# EAGLE design ELEKTRA-PMIC v0.3-35X22.86-0.8-323 (EAGLE 9.6.2)
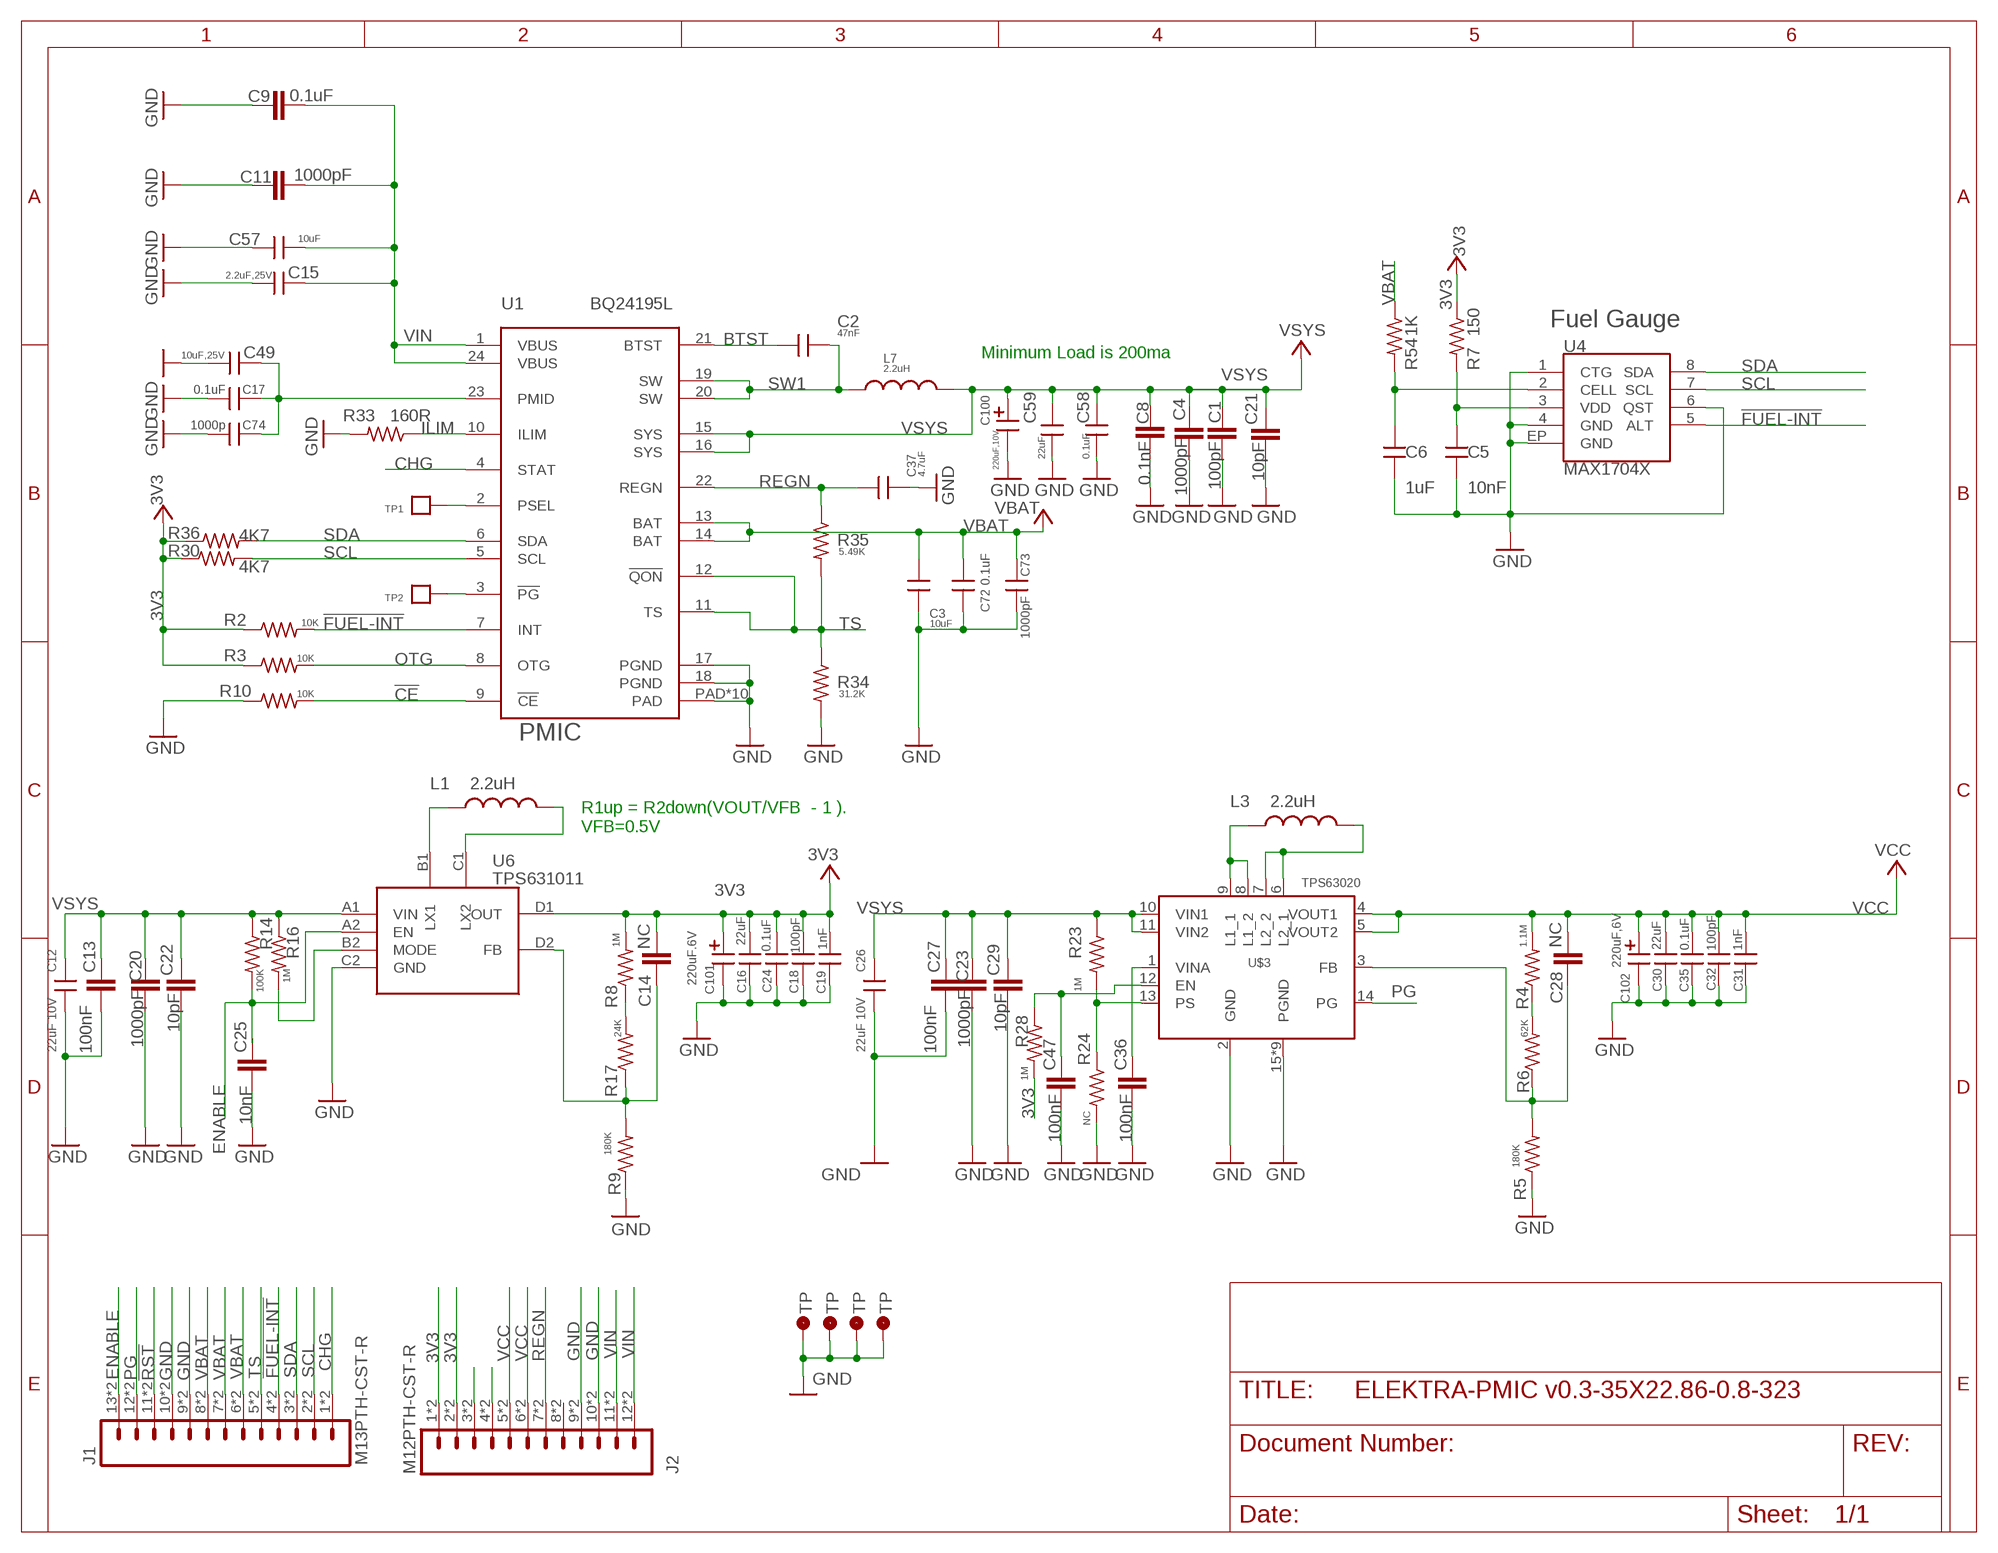
[diagram p0: schematic, sheet 1]

## Parts
C1  100pF  CAP_1  [C0402_B]
C2  47nF  CAP0402  [C-0402]
C3  10uF  CAPC0805  [C0805]
C4  1000pF  CAP_1  [C0402_B]
C5  10nF  CAP0402A  [C0402]
C6  1uF  CAP0402A  [C0402]
C8  0.1nF  CAP_1  [C0402_B]
C9  0.1uF  CAP_1  [C0402_B]
C11  1000pF  CAP_1  [C0402_B]
C12  22uF 10V  CAPC0805  [C0805]
C13  100nF  CAP_1  [C0402_B]
C14  NC  CAP_1  [C0402_B]
C15  2.2uF,25V  CAP0603A  [C-0603A]
C16  22uF  CAP0603A  [C-0603A]
C17  0.1uF  CAP0402A  [C0402]
C18  100pF  CAP0402A  [C0402]
C19  1nF  CAP0402A  [C0402]
C20  1000pF  CAP_1  [C0402_B]
C21  10pF  CAP_1  [C0402_B]
C22  10pF  CAP_1  [C0402_B]
C23  1000pF  CAP_1  [C0402_B]
C24  0.1uF  CAP0402A  [C0402]
C25  10nF  CAP_1  [C0402_B]
C26  22uF 10V  CAPC0805  [C0805]
C27  100nF  CAP_1  [C0402_B]
C28  NC  CAP_1  [C0402_B]
C29  10pF  CAP_1  [C0402_B]
C30  22uF  CAP0603A  [C-0603A]
C31  1nF  CAP0402A  [C0402]
C32  100pF  CAP0402A  [C0402]
C35  0.1uF  CAP0402A  [C0402]
C36  100nF  CAP_1  [C0402_B]
C37  4.7uF  CAP0402A  [C0402]
C47  100nF  CAP_1  [C0402_B]
C49  10uF,25V  CAP0603A  [C-0603A]
C57  10uF  CAP0603A  [C-0603A]
C58  0.1uF  CAP0402A  [C0402]
C59  22uF  CAPC0603  [C0603]
C72  0.1uF  CAP0402  [C-0402]
C73  1000pF  CAP0402  [C-0402]
C74  1000p  CAP0402  [C-0402]
C100  220uF,10V  CAP-ECASE_B  [CASE-B]
C101  220uF.6V  CAP-ECASE_B  [CASE-B]
C102  220uF,6V  CAP-ECASE_B  [CASE-B]
J1  M13PTH-CST-R  [1X13-CASTELLATED]
J2  M12PTH-CST-R  [1X12-CASTELLATED]
L1  2.2uH  INDUCTOR-SPARKFUNINDUCTOR-2520  [INDUCTOR-2520]
L3  2.2uH  INDUCTOR-SPARKFUNINDUCTOR-2520  [INDUCTOR-2520]
L7  2.2uH  INDUCTORI  [INDUCTOR-4040]
R2  10K  R-US_  [R0402_B]
R3  10K  R-US_  [R0402_B]
R4  1.1M  R-US_  [R0402_B]
R5  180K  R-US_  [R0402_B]
R6  62K  R-US_  [R0402_B]
R7  150  R-US_  [R0402_B]
R8  1M  R-US_  [R0402_B]
R9  180K  R-US_  [R0402_B]
R10  10K  R-US_  [R0402_B]
R14  100K  R-US_  [R0402_B]
R16  1M  R-US_  [R0402_B]
R17  24K  R-US_  [R0402_B]
R23  1M  R-US_  [R0402_B]
R24  NC  R-US_  [R0402_B]
R28  1M  R-US_  [R0402_B]
R30  4K7  R-US_  [R0402_B]
R33  160R  R-US_  [R0402_B]
R34  31.2K  R-US_  [R0402_B]
R35  5.49K  R-US_  [R0402_B]
R36  4K7  R-US_  [R0402_B]
R54  1K  R-US_  [R0402_B]
TP1  TP1311MM  [TP-1311MM]
TP2  TP1311MM  [TP-1311MM]
U1  BQ24195L  BQ24298RTWR  [QFN24]
U4  MAX1704X  [TDFN-8]
U6  TPS631011  TPS631010  [DSBGA]
U$1  TP  [TP_2.33X1.37]
U$2  TP  [TP_2.33X1.37]
U$3  TPS63020  [TPS63020]
U$4  TP  [TP_2.33X1.37]
U$5  TP  [TP_2.33X1.37]

## Nets
3V3: C14.2 C16.1 C18.1 C19.1 C24.1 C101.P$1 J2.1 J2.2 J2.@1 J2.@2 R2.1 R3.1 R7.1 R8.2 R28.2 R30.1 R36.1 U6.D1(OUT)
!CE: R10.2 U1.9(!CE)
!FUEL-INT: J1.4 J1.@4 R2.2 U1.7(INT) U4.5(ALT)
!RST: J1.11 J1.@11
BTST: C2.1 U1.21(BTST)
CHG: J1.1 J1.@1 U1.4(STAT)
ENABLE: C25.2 J1.13 J1.@13 R14.2 U6.A2(EN)
GND: C1.1 C3.2 C4.1 C5.2 C6.2 C8.1 C9.1 C11.1 C12.2 C13.1 C15.2 C16.2 C17.1 C18.2 C19.2 C20.1 C21.1 C22.1 C23.1 C24.2 C25.1 C26.2 C27.1 C29.1 C30.2 C31.2 C32.2 C35.2 C36.1 C37.2 C47.1 C49.2 C57.2 C58.2 C59.2 C72.2 C73.2 C74.1 C100.P$2 C101.P$2 C102.P$2 J1.9 J1.10 J1.@9 J1.@10 J2.9 J2.10 J2.@9 J2.@10 R5.1 R9.1 R10.1 R24.2 R33.2 R34.2 U1.17(PGND) U1.18(PGND) U1.PAD U1.PAD@1(PAD) U1.PAD@2(PAD) U1.PAD@3(PAD) U1.PAD@4(PAD) U1.PAD@5(PAD) U1.PAD@6(PAD) U1.PAD@7(PAD) U1.PAD@8(PAD) U1.PAD@9(PAD) U4.1(CTG) U4.4(GND) U4.6(QST) U4.EP(GND) U6.C2(GND) U$1.1(TP) U$2.1(TP) U$3.2(GND) U$3.15(PGND) U$3.16(PGND) U$3.17(PGND) U$3.18(PGND) U$3.19(PGND) U$3.20(PGND) U$3.21(PGND) U$3.22(PGND) U$3.23(PGND) U$4.1(TP) U$5.1(TP)
ILIM: R33.1 U1.10(ILIM)
N$1: J2.3 J2.@3
N$2: C17.2 C49.1 C74.2 U1.23(PMID)
N$4: TP2.P$1 U1.3(!PG)
N$5: C14.1 R9.2 R17.1 U6.D2(FB)
N$6: C28.1 R5.2 R6.1 U$3.3(FB)
N$7: TP1.P$1 U1.2(PSEL)
N$8: R8.1 R17.2
N$9: R4.1 R6.2
N$10: J2.4 J2.@4
N$11: L3.1 U$3.8(L1_2) U$3.9(L1_1)
N$12: L1.1 U6.B1(LX1)
N$15: R16.2 U6.B2(MODE)
N$16: L3.2 U$3.6(L2_1) U$3.7(L2_2)
N$17: L1.2 U6.C1(LX2)
N$19: C36.2 U$3.1(VINA)
N$21: C47.2 R28.1 U$3.12(EN)
N$22: R23.2 R24.1 U$3.13(PS)
N$48: C5.1 R7.2 U4.3(VDD)
N$49: C6.1 R54.2 U4.2(CELL)
OTG: R3.2 U1.8(OTG)
PG: J1.12 J1.@12 U$3.14(PG)
REGN: C37.1 J2.7 J2.@7 R35.1 U1.22(REGN)
SCL: J1.2 J1.@2 R30.2 U1.5(SCL) U4.7(SCL)
SDA: J1.3 J1.@3 R36.2 U1.6(SDA) U4.8(SDA)
SW1: C2.2 L7.P$1 U1.19(SW) U1.20(SW)
TS: J1.5 J1.@5 R34.1 R35.2 U1.11(TS) U1.12(!QON)
VBAT: C3.1 C72.1 C73.1 J1.6 J1.7 J1.8 J1.@6 J1.@7 J1.@8 R54.1 U1.13(BAT) U1.14(BAT)
VCC: C28.2 C30.1 C31.1 C32.1 C35.1 C102.P$1 J2.5 J2.6 J2.@5 J2.@6 R4.2 U$3.4(VOUT1) U$3.5(VOUT2)
VIN: C9.2 C11.2 C15.1 C57.1 J2.11 J2.12 J2.@11 J2.@12 U1.1(VBUS) U1.24(VBUS)
VSYS: C1.2 C4.2 C8.2 C12.1 C13.2 C20.2 C21.2 C22.2 C23.2 C26.1 C27.2 C29.2 C58.1 C59.1 C100.P$1 L7.P$2 R14.1 R16.1 R23.1 U1.15(SYS) U1.16(SYS) U6.A1(VIN) U$3.10(VIN1) U$3.11(VIN2)
Unconnected: J2.8 J2.@8

## Notes on the sheet
- Fuel Gauge
- Minimum Load is 200ma
- PMIC
- R1up = R2down(VOUT/VFB  - 1 ).
  VFB=0.5V

## Library data of the parts
C1 = Particle:CAP_1; ITEM_NAME: CAP CER 100pF 50V X7R 0402 10%; ITEM_NUMBER: PT-200138
C2 = particle SZ:CAP: CAP; ITEM_NAME: CAP CER 0.1uF 16V X7R 0402 10%; ITEM_NUMBER: PT-200005
C3 C37 C58 C59 = particle SZ:CAP: CAP; ITEM_NAME: CAP CER 10uF 6.3V X5R 0603 10% Low ESR<70mohms; ITEM_NUMBER: PT-200209
C4 C20 C23 = Particle:CAP_1; ITEM_NAME: CAP CER 1000PF 50V X7R 0402 10%
C5 = particle SZ:CAP: CAP; ITEM_NAME: CAP CER 10nF 16V X5R 0402 10%; ITEM_NUMBER: PT-200136
C6 = particle SZ:CAP: CAP; ITEM_NAME: CAP CER X5R 1uF 0402 10V ±10% ROHS; ITEM_NUMBER: PT-200695
C8 C13 C27 = Particle:CAP_1; ITEM_NAME: CAP CER 0.1UF 16V X7R 0402 10%; ITEM_NUMBER: PT-200649
C9 = Particle:CAP_1; ITEM_NAME: CAP CER 0.1UF 25V X7R 0402 20%; ITEM_NUMBER: PT-200690
C11 = Particle:CAP_1; ITEM_NAME: CAP CER 1000PF 50V X7R 0402 10%; ITEM_NUMBER: PT-200631
C12 C26 = particle SZ:CAP: CAP; ITEM_NAME: CAP CER 0.1UF 16V X7R 0402 10%; ITEM_NUMBER: 120-00060
C14 C25 C28 C36 C47 = Particle:CAP_1
C15 C49 C57 = particle SZ:CAP: CAP; ITEM_NAME: CAP CER 100PF 50V C0G/NP0 0603 5%; ITEM_NUMBER: PT-200458
C16 C30 = particle SZ:CAP: CAP; ITEM_NAME: CAP CER 22UF 10V X5R 0603 20%; ITEM_NUMBER: 120-00061
C17 = RedBear:CAP: CAP; ITEM_NAME: CAP CER 0.1UF 25V X7R 0402 20%; ITEM_NUMBER: PT-200690
C18 C32 = particle SZ:CAP: CAP; ITEM_NAME: 100pF 50V X7R 0402 10%; ITEM_NUMBER: PT-200138
C19 C31 C73 = particle SZ:CAP: CAP; ITEM_NAME: 1000PF 50V X7R 0402 10%; ITEM_NUMBER: PT-200631
C21 C22 C29 = Particle:CAP_1; ITEM_NAME: CAP CER 10PF 5% 50V C0G/NP0 0402; ITEM_NUMBER: 120-00038
C24 C35 = particle SZ:CAP: CAP; ITEM_NAME: 0.1UF 16V X7R 0402 10%; ITEM_NUMBER: PT-200649
C72 = particle SZ:CAP: CAP; ITEM_NAME: CAP CER 0.1UF 16V X7R 0402 10%; ITEM_NUMBER: PT-200649
C74 = particle SZ:CAP: CAP; ITEM_NAME: CAP CER 1000PF 50V X7R 0402 10%; ITEM_NUMBER: PT-200631
C100-C102 = particle SZ:CAP-E
J1 = Particle:M13PTH-CST-R
J2 = Particle:M12: Header 12 Standard 12-pin 0.1" header. Use with straight break away headers (SKU : PRT-00116), right angle break away headers (PRT-00553), swiss pins (PRT-00743), machine pins (PRT-00117), and female headers (PRT-00115).
L1 L3 = Particle:INDUCTOR-SPARKFUN: Inductors Basic Inductor/Choke - 0603 and 1206. Footprints are not proven and vary greatly between part numbers. SRN6045- 33uH, 20% 1.4A
L7 = Particle:INDUCTOR; ITEM_NAME: FIXED IND 1UH 5.8A 26 MOHM SMD 4020; ITEM_NUMBER: 155-00005
R2 R3 R10 = Spark:R-US_: 0402 Resistor; ITEM_NAME: 10K OHM 5% 1/16W 0402; ITEM_NUMBER: PT-200004
R4-R6 R9 R24 R28 R34 R35 = Spark:R-US_: 0402 Resistor
R7 R33 = Particle:R-US_: 0402 Resistor
R8 R14 R16 R23 = Spark:R-US_: 0402 Resistor; ITEM_NAME: RES SMD 1M OHM 1% 1/16W 0402; ITEM_NUMBER: PT-201084
R17 = Spark:R-US_: 0402 Resistor; ITEM_NAME: RES SMD 24K OHM 1% 1/16W 0402; ITEM_NUMBER: PT-201025
R30 R36 = Particle:R-US_: 0402 Resistor; ITEM_NAME: RES SMD 4K7 OHM 5% 1/16W 0402; ITEM_NUMBER: PT-200230
R54 = Particle:R-US_: 0402 Resistor; ITEM_NAME: RES SMD 1K OHM 5% 1/16W 0402; ITEM_NUMBER: PT-200002
TP1 TP2 = particle SZ:TP
U1 = electron:BQ24298RTWR: Bq24298 I2C Controlled 3A Single Cell USB Charger with Narrow VDC Power Path Management and Adjustable Voltage USB OTG; ITEM_NAME: IC BATT CHG LI-ION 1CELL 24VQFN 2.5A CHG CURRENT; ITEM_NUMBER: 150-00013
U4 = SparkFun-PowerIC:MAX1704X: MAX17043/MAX17044: Battery Fuel Guage (43 is 1cell, 44 is 2cell); ITEM_NAME: IC 2-WIRE FG MODEL GAUGE LO BATT; ITEM_NUMBER: PT-200141
U6 = particle SZ:TPS631010
U$1 U$2 U$4 U$5 = Particle:TP: Test Points of all sizes and shapes
U$3 = particle SZ:TPS63020

## Net classes
0 default: width 0.152 mm, drill 0.203 mm, clearance 0.152 mm
1 power: width 0.305 mm, drill 0.203 mm, clearance 0.203 mm
3 BAT: drill 0.203 mm, clearance 0.203 mm
4 3V3: width 0.305 mm, drill 0.203 mm, clearance 0.508 mm
6 +3V3: width 0.203 mm, drill 0.203 mm, clearance 0.152 mm

## Board
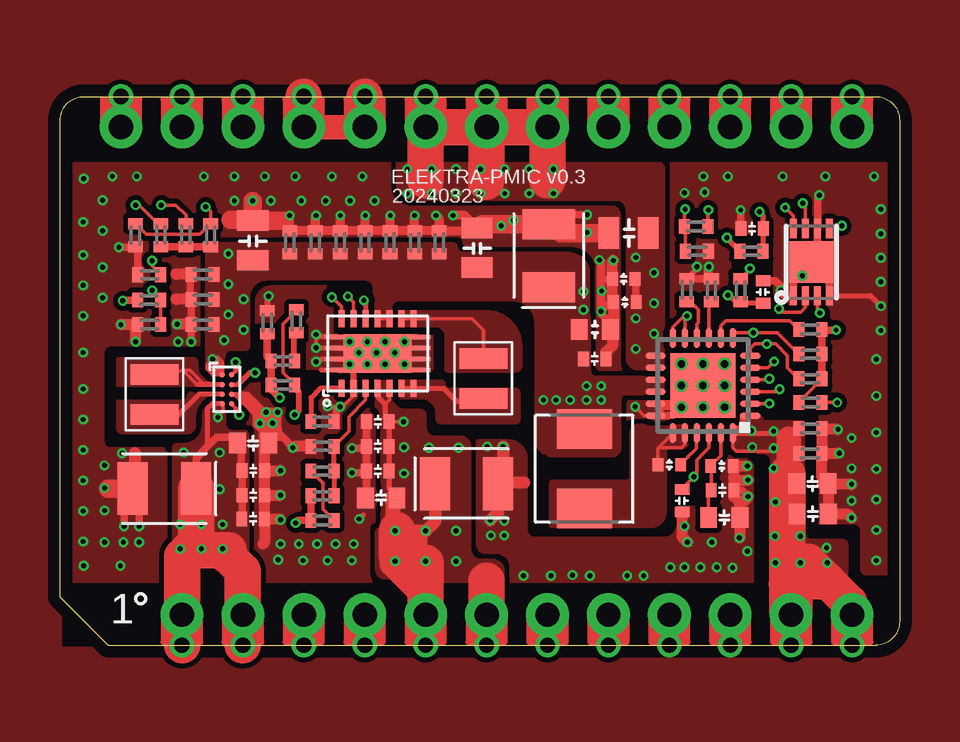
[diagram p1: board, top side]
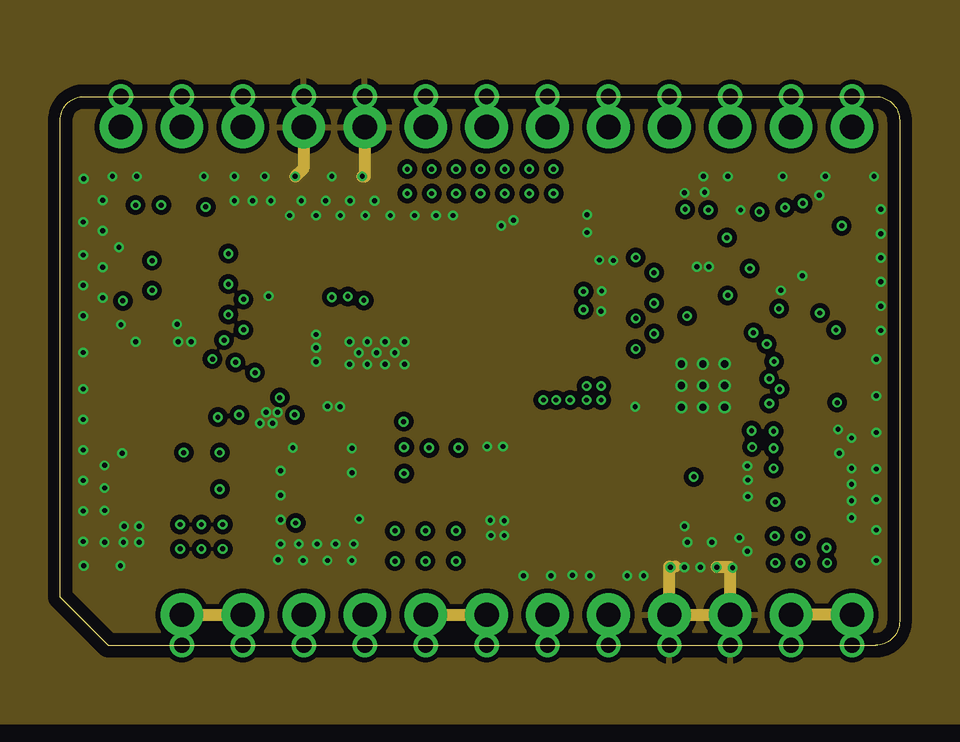
[diagram p2: board, inner layer Route2]
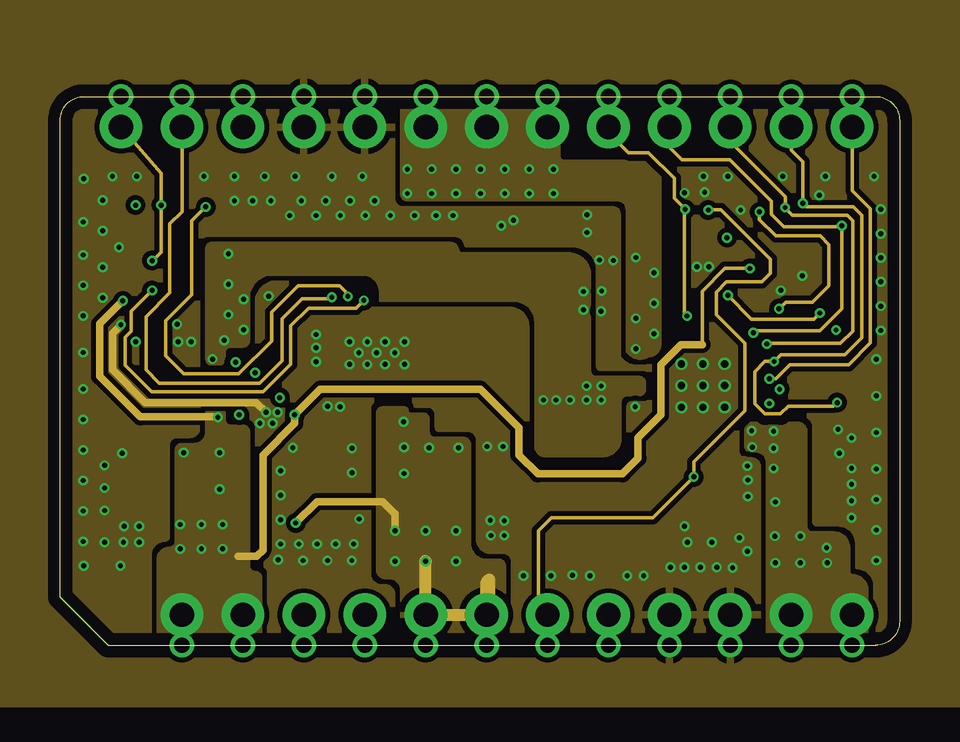
[diagram p3: board, inner layer Route15]
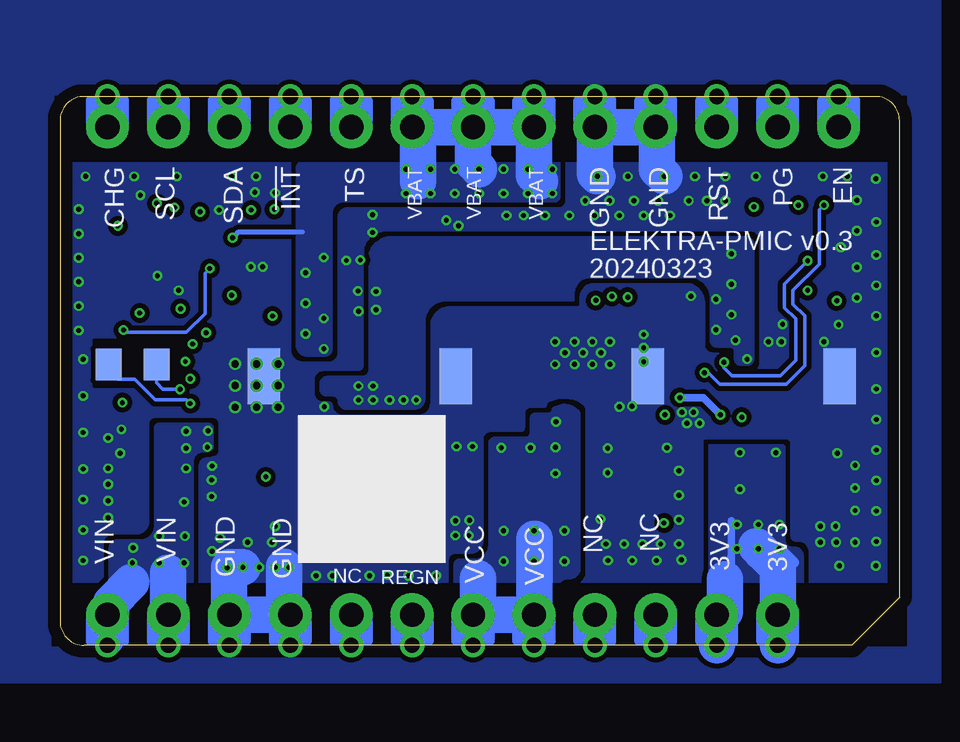
[diagram p4: board, bottom side, seen from below]

Size 35 x 22.86 mm. Coordinates in mm from the lower left corner, seen from the top.
Outline: 2,0 34,0 arc90 35,1 35,21.86 arc90 34,22.86 1,22.86 arc90 0,21.86 0,2 2,0
Copper layers (1+2*15+16): Top 0.035mm / dielectric 1.5mm / Route2 0.035mm / dielectric 0.15mm / Route15 0.035mm / dielectric 0.2mm / Bottom 0.035mm
Design rules "default *": minimum track width 4mil, minimum drill 8mil, track to track 8mil, track to pad 6mil, pad to pad 6mil, via to via 6mil, smd to smd 6mil, copper to edge 20mil, drill to drill 6mil, minimum pad ring 4mil, minimum via ring 4mil, stop-mask expansion 0.01mm, vias tented up to drill 16mil, thermal gap 10mil

### Footprints (pad centres in the part's own frame; a part is rotated, then mirrored left to right if it is on the bottom)
C0402_B = smd 0.457 x 0.61: 1 -0.483,0; 2 0.483,0
C-0402 = smd 0.45 x 0.55: 1 -0.47,0; 2 0.47,0
C0805 = smd 0.85 x 1.3: 1 -0.8,0; 2 0.85,0
C0402 = smd 0.45 x 0.6: 1 -0.47,0; 2 0.47,0
C-0603A = smd 0.7 x 0.85: 1 -0.65,0; 2 0.65,0
C0603 = smd 0.7 x 0.85: 1 -0.65,0; 2 0.65,0
CASE-B = smd 2.2 x 1.25: P$1 0,-1.32; P$2 0,1.32
1X13-CASTELLATED = drill 1.016 pad 1.778: 1 0,-15.24; 2 0,-12.7; 3 0,-10.16; 4 0,-7.62; 5 0,-5.08; 6 0,-2.54; 7 0,0; 8 0,2.54; 9 0,5.08; 10 0,7.62; 11 0,10.16; 12 0,12.7; 13 0,15.24 | drill 0.635 pad 1.016: @1 1.27,-15.24; @2 1.27,-12.7; @3 1.27,-10.16; @4 1.27,-7.62; @5 1.27,-5.08; @6 1.27,-2.54; @7 1.27,0; @8 1.27,2.54; @9 1.27,5.08; @10 1.27,7.62; @11 1.27,10.16; @12 1.27,12.7; @13 1.27,15.24
1X12-CASTELLATED = drill 1.016 pad 1.778: 1 0,-13.97; 2 0,-11.43; 3 0,-8.89; 4 0,-6.35; 5 0,-3.81; 6 0,-1.27; 7 0,1.27; 8 0,3.81; 9 0,6.35; 10 0,8.89; 11 0,11.43; 12 0,13.97 | drill 0.635 pad 1.016: @1 1.27,-13.97; @2 1.27,-11.43; @3 1.27,-8.89; @4 1.27,-6.35; @5 1.27,-3.81; @6 1.27,-1.27; @7 1.27,1.27; @8 1.27,3.81; @9 1.27,6.35; @10 1.27,8.89; @11 1.27,11.43; @12 1.27,13.97
INDUCTOR-2520 = smd 0.85 x 2: 1 -0.83,0; 2 0.83,0
INDUCTOR-4040 = smd 1.65 x 2.3: P$1 -1.65,0; P$2 1.65,0
R0402_B = smd 0.457 x 0.61: 1 -0.483,0; 2 0.483,0
TP-1311MM = smd 1.1 x 1.3: P$1 0,0
QFN24 = smd 0.85 x 0.28: 1 -1.975,1.25; 2 -1.975,0.75; 3 -1.975,0.25; 4 -1.975,-0.25; 5 -1.975,-0.75; 6 -1.975,-1.25; 13 1.975,-1.25; 14 1.975,-0.75; 15 1.975,-0.25; 16 1.975,0.25; 17 1.975,0.75; 18 1.975,1.25 | smd 0.28 x 0.85: 7 -1.25,-1.975; 8 -0.75,-1.975; 9 -0.25,-1.975; 10 0.25,-1.975; 11 0.75,-1.975; 12 1.25,-1.975; 19 1.25,1.975; 20 0.75,1.975; 21 0.25,1.975; 22 -0.25,1.975; 23 -0.75,1.975; 24 -1.25,1.975 | smd 2.7 x 2.7: PAD 0,0 | drill 0.3 pad 0.406: PAD@1 -0.9,0.9; PAD@2 0,0.9; PAD@3 0.9,0.9; PAD@4 -0.9,0; PAD@5 0,0; PAD@6 0.9,0; PAD@7 -0.9,-0.9; PAD@8 0,-0.9; PAD@9 0.9,-0.9
TDFN-8 = smd 0.8 x 0.3: 1 -1.4,0.75; 2 -1.4,0.25; 3 -1.4,-0.25; 4 -1.4,-0.75; 5 1.4,-0.75; 6 1.4,-0.25; 7 1.4,0.25; 8 1.4,0.75 | smd 1.73 x 1.88: EP 0,0
DSBGA = smd 0.23 x 0.23: A1 -0.2,0.6; A2 0.2,0.6; B1 -0.2,0.2; B2 0.2,0.2; C1 -0.2,-0.2; C2 0.2,-0.2; D1 -0.2,-0.6; D2 0.2,-0.6
TP_2.33X1.37 = smd 1.37 x 2.33: 1 0,-0.23
TPS63020 = smd 0.25 x 0.7: 1 -1.5,-1.45; 2 -1,-1.45; 3 -0.5,-1.45; 4 0,-1.45; 5 0.5,-1.45; 6 1,-1.45; 7 1.5,-1.45; 8 1.5,1.45; 9 1,1.45; 10 0.5,1.45; 11 0,1.45; 12 -0.5,1.45; 13 -1,1.45; 14 -1.5,1.45 | smd 1.1 x 0.2: 15 -1.65,0.69; 16 -1.65,0.23; 17 -1.65,-0.23; 18 -1.65,-0.69; 19 1.65,-0.69; 20 1.65,-0.23; 21 1.65,0.23; 22 1.65,0.69 | smd 2.85 x 1.58: 23 0,0

### Placement (x,y rotation side)
C1  13.76,16.79 270 top
C2  25.4,7.52 180 top
C3  23.73,17.17 180 top
C4  14.79,16.79 270 top
C5  29.31,14.71 90 top
C6  28.85,17.36 180 top
C8  15.81,16.79 270 top
C9  31.29,7.99 180 top
C11  31.29,9.03 180 top
C12  8.04,16.84 90 top
C13  5.95,15.45 0 top
C14  9.29,10.84 0 top
C15  31.37,6.73 0 top
C16  8.06,8.42 0 top
C17  27.62,6.46 180 top
C18  8.06,6.25 0 top
C19  8.06,7.28 0 top
C20  5.95,14.41 0 top
C21  12.72,16.79 270 top
C22  5.95,13.37 0 top
C23  10.65,16.79 270 top
C24  8.05,5.27 0 top
C25  3.72,15.44 0 top
C26  17.39,16.54 90 top
C27  11.69,16.79 270 top
C28  10.94,6.23 180 top
C29  9.58,16.79 270 top
C30  13.39,6.14 180 top
C31  13.25,9.32 180 top
C32  13.25,8.29 180 top
C35  13.25,7.25 180 top
C36  10.94,9.32 180 top
C37  25.93,6.02 270 top
C47  3.72,13.36 0 top
C49  27.69,5.32 0 top
C57  31.38,5.47 0 top
C58  22.29,11.93 0 top
C59  22.3,13.15 0 top
C72  23.55,14.3 180 top
C73  23.5,15.26 180 top
C74  27.59,7.47 180 top
C100  20.37,16.23 0 top
C101  4.35,6.53 90 top
C102  16.95,6.73 270 top
J1  17.78,21.59 90 top
J2  19.05,1.27 270 top
L1  3.94,10.45 270 top
L3  17.65,11.12 270 top
L7  21.86,7.35 90 top
R2  31.29,12.13 180 top
R3  31.29,13.16 180 top
R4  10.94,5.2 180 top
R5  10.94,8.29 0 top
R6  10.94,7.25 180 top
R7  28.37,14.79 270 top
R8  9.86,13.5 90 top
R9  8.64,13.45 270 top
R10  27.16,14.79 270 top
R14  5.25,17.09 90 top
R16  4.21,17.09 90 top
R17  9.29,11.85 0 top
R23  6.28,17.09 90 top
R24  3.15,17.09 270 top
R28  3.72,14.38 180 top
R30  31.29,10.12 0 top
R33  26.13,14.79 90 top
R34  26.55,16.42 0 top
R35  26.52,17.45 180 top
R36  31.29,11.1 180 top
R54  28.82,16.42 0 top
TP1  32.97,11.7 180 bottom
TP2  30.97,11.7 180 bottom
U1  26.81,10.82 180 top
U4  31.33,15.96 90 top
U6  6.96,10.66 0 top
U$1  2.5,11.43 0 bottom
U$2  10.5,11.43 0 bottom
U$3  13.24,12.15 0 top
U$4  18.5,11.43 0 bottom
U$5  26.5,11.43 0 bottom

### Tracks (layer width: path | path; a pad name or v marks a point on that pad's centre or on a via)
3V3  (via drill 0.2 pad 0.41)
  Top 0.152: 2.65,14.38 v2.62,14.35 | R8.2 9.86,13.95 9.3,13.39 9.3,11.36 9.77,10.89 C14.2 | 5.01,3.58 5.14,3.71 5.14,3.76 4.93,3.96 | R7.1 28.76,15.66 v28.76,15.7 | U6.D1 6.76,10.01 6.81,9.96 6.81,9.73 v6.58,9.5 | R30.1 31.11,10.44 R36.1
  Top 0.203: 6.14,8.27 6.14,9.84 6.36,10.06 U6.D1 | 5.87,7.49 5.67,7.29 | R2.1 R3.1 32.33,13.16 v32.35,13.13
  Top 0.254: v9.78,9.6 9.95,9.77 9.95,10.56 9.77,10.73 C14.2 | J2.2 7.37,1.32
  Top 0.305: C24.1 C18.1 C19.1 7.55,7.32 7.55,8.28 C16.1 7.17,8.66 6.53,8.66 6.14,8.27 5.67,7.8 C101.P$1 5.67,7.29 | v32.35,13.13 31.82,13.13 31.77,13.08 R36.1 | R28.2 2.65,14.38
  Top 0.508: J2.2 7.42,1.63
  Top 1.524: 5.34,3.96 5.08,3.71 | 5.34,3.96 7.04,3.96 7.04,3.68 7.62,3.1 J2.2 J2.@2 | C101.P$1 5.67,4.29 5.34,3.96 | J2.1 J2.@1 5.08,3.66 5.14,3.71
  Route2 0.508: J2.@1 J2.1 J2.2 J2.@2
  Route15 0.152: v28.76,15.7 27.72,15.7 26.78,14.76 26.78,12.52
  Route15 0.305: 26.78,12.52 25.89,12.52 25.05,11.68 25.05,9.6 24.1,8.65 24.1,7.79 23.45,7.14 19.92,7.14 19.13,7.92 19.13,9.07 17.53,10.67 10.85,10.67 v9.78,9.6 9.78,9.25 8.46,7.92 8.46,3.96 8.21,3.71 7.42,3.71 | v2.62,14.35 1.66,13.39 1.66,11.2 3.34,9.51 6.57,9.51 v6.58,9.5
  Route15 0.508: J2.@1 J2.1 | J2.@2 J2.2
  Bottom 0.152: 7.01,5.18 7.01,5.13 | v32.35,13.13 32.25,13.03 29.75,13.03 28.96,13.82 28.96,15.49 v28.76,15.7
  Bottom 0.203: J2.1 4.88,1.03 5.29,0.61 5.29,0.86
  Bottom 0.305: 7.01,5.18 7.01,3.66 | 7.01,3.66 7.01,1.68 J2.2 | 7.04,3.68 7.01,3.66
  Bottom 0.457: 4.42,3.45 4.93,3.96
  Bottom 1.524: 7.29,2.74 7.29,1.4 J2.2 J2.@2 | 5.97,4.12 5.77,3.91 5.78,3.89 5.08,3.2 J2.1 J2.@1
  other vias: 6.66,8.03 5.16,8.03 6.66,6.5 5.01,5.03 5.9,5.03 5.9,4.01 6.79,5.03 5.01,4.01 6.79,4.01
  pour Top (isolate 0.305, no thermals): 6.88,10.09 6.53,10.09 arc90 5.96,9.53 5.96,9.2 arc-90 5.14,8.38 4.88,8.38 arc90 4.73,8.23 4.73,3.3 7.67,3.3 arc90 7.85,3.48 7.85,8.79 arc90 7.73,8.92 7.22,8.92 arc-90 6.88,9.25
  pour Route15 (no thermals): 6.1,9.65 6.1,8.89 arc-90 5.59,8.38 5.08,8.38 arc90 4.83,8.13 4.83,4.83 4.83,4.32 arc-90 4.58,4.06 arc90 4.07,3.56 4.07,0 8.13,0 arc90 8.39,0.25 8.39,2.54 8.39,2.79 arc90 8.13,3.05 arc-90 7.88,3.3 7.88,8.13 7.88,8.64 7.88,8.89 arc90 7.62,9.14 7.12,9.14 arc-90 6.86,9.4 6.86,9.65 arc90 6.61,9.91 6.35,9.91 arc90
  pour Bottom (no thermals): 4.91,8.33 7.93,8.33 7.93,2.64 7.85,2.57 arc-90 7.85,2.54 4.07,2.54 arc-90 4.04,2.57 4.04,3.71 arc-90 4.4,4.06 4.5,4.06 arc90 4.8,4.37 4.8,8.23 arc-90
!CE
  Top 0.152: R10.2 27.18,14.29 27.06,14.17 U1.9
!FUEL-INT  (via drill 0.2 pad 0.41)
  Top 0.152: v32.59,17.48 32.19,17.48 U4.5 | U1.7 28.06,13.02 v28.91,13.02 v28.92,13.02 29.92,13.02 R2.2
  Top 0.508: J1.@4 J1.4
  Route2 0.508: J1.@4 J1.4
  Route15 0.152: J1.4 25.4,20.75 25.94,20.22 27.92,20.22 29.65,18.49 29.65,17.96 30.17,17.44 32.55,17.44 v32.59,17.48 v32.59,17.47 32.59,14.02 31.68,13.11 29.03,13.11 28.93,13.01 v28.91,13.02
  Route15 0.508: J1.@4 J1.4
!RST
  Top 0.508: J1.@11 J1.11
  Route2 0.508: J1.@11 J1.11
  Route15 0.152: 7.62,21.61 J1.11
  Route15 0.508: J1.@11 7.62,21.61
  Bottom 0.152: 7.37,22.27 J1.11
BTST
  Top 0.152: U1.21 26.52,8.81 26.52,8.19 26.19,7.86 26.19,7.83 C2.1
CHG  (via drill 0.2 pad 0.41)
  Top 0.152: v29.57,11.1 29.54,11.07 U1.4
  Top 0.508: J1.@1 J1.1
  Route2 0.508: J1.@1 J1.1
  Route15 0.152: v29.57,11.1 29.85,11.1 30.43,11.68 32.88,11.68 33.79,12.59 33.79,18.18 33.02,18.94 J1.1
  Route15 0.508: J1.@1 J1.1
  Bottom 0.152: J1.@1 32.77,22.25
  Bottom 0.203: 32.77,22.25 32.77,22
ENABLE  (via drill 0.2 pad 0.41)
  Top 0.152: 7.31,11.42 U6.A2 | R14.2 5.25,17.92 4.83,18.34 v4.22,18.34 | C25.2 3.84,15.8 v3.84,16.02
  Top 0.203: 7.31,11.42 v7.31,11.78 v7.32,11.79
  Top 0.508: J1.@13 J1.13
  Route2 0.508: J1.@13 J1.13
  Route15 0.152: J1.13 4.22,19.66 v4.22,18.34 4.22,16.38 3.87,16.02 v3.84,16.02
  Route15 0.508: J1.@13 J1.13
  Bottom 0.152: J1.13 2.29,22.27 | v7.32,11.79 7.32,11.56 7,11.23 4.97,11.23 4.33,11.88 4.33,13.6 4.8,14.07 4.8,15.04 3.84,16 v3.84,16.02
GND  (via drill 0.2 pad 0.41)
  Top 0.152: U$3.21 14.71,12.38 | U$3.23 13.58,12.15 | 11.06,12.84 U$3.15 12.61,12.84 v12.81,12.64 12.81,12.58 U$3.23 | 11.86,11.46 U$3.18 12.58,11.46 v12.81,11.7 | U1.18 24.34,9.57 v23.98,9.93 | C20.1 C22.1 5.47,13.23 v5.47,12.65 | 23.04,13.28 C59.2 | C37.2 25.93,5.06 v26.04,4.95 | 9.91,21.64 9.91,22.27 | 14.6,11.46 v14.36,11.7 | 12.3,11.92 12.37,11.92 12.61,12.15 U$3.23 | 12.59,11.92 v12.81,11.7 | 12.24,11.87 12.3,11.92 | 12.3,11.92 | 12.23,10.45 12.23,10.38 11.63,9.78 11.61,9.78 | 11.61,9.78 11.42,9.6 C36.1 11.42,9.92 | 11.42,9.92 11.38,9.96 v11.16,9.96 | 11.61,9.78 11.56,9.78 11.42,9.92 | 8.53,8.53 8.53,8.25 | v10.67,12.39 10.67,12.84 | U6.C2 7.5,10.46 | 8.13,10.01 7.92,10.22 7.89,10.22 | 8.27,9.79 8.05,10.01 7.83,10.23 7.72,10.34 7.43,10.34 | 8.36,9.7 8.56,9.7 | 12.59,11.92 v12.81,11.7 | 12.55,11.46 U$3.23 | 12.24,12.05 12.35,12.15 | U$3.23 13.88,12.15 v14.36,12.64 | 14.5,11.92 14.37,12.05 | 26.96,15.53 27.01,15.48 | v28.66,7.47
  Top 0.203: 12.23,10.45 12.24,10.47 U$3.2 | 26.17,10.07 27.28,10.07 | C36.1 11.42,9.6 11.68,9.85 v11.68,9.93 | C35.2 12.68,7.25 12.62,7.19 v12.17,7.19 | 12.6,8.26 12.6,8.24 12.57,8.2 v12.17,8.2 | v12.48,5.26 12.65,5.43 | 12.24,11.2 12.24,11.87 | 10.67,12.38 U$3.16 12.26,12.38 v12.46,12.18 | 10.89,11.46 U$3.18 12.55,11.46 | 8.13,10.01 8.05,10.01 | 7.5,10.46 7.65,10.46 | 7.65,10.46 7.89,10.22 | 8.56,9.7 8.07,9.7 | U6.C2 7.18,10.44 7.33,10.44 7.43,10.34 7.5,10.27 | 8.07,9.7 7.5,10.27 | 7.5,10.27 7.79,10.27 7.83,10.23 7.83,10.13 8.17,9.79 8.27,9.79 8.36,9.7 v8.59,9.7 8.59,9.68 8.56,9.7 | 7.65,10.46 7.81,10.46 8.51,9.75 8.56,9.7 | 8.07,9.7 8.53,9.24 8.53,9.02 | v26.55,15.76 26.55,15.7 R33.2 | 12.59,11.92 U$3.17 10.9,11.92 10.79,11.81 v10.67,11.81 | U4.4 33.79,14.56 v34.22,14.13 | v12.08,12.64 11.87,12.84 U$3.15 10.78,12.84 v10.67,12.95 | U$3.22 14.56,12.84 v14.36,12.64 14.62,12.38 U$3.21 | U$3.20 14.59,11.92 v14.36,11.7 | U1.17 26.66,10.07 U1.PAD@2 25.18,9.92 U1.18 | U$3.19 14.58,11.46 13.89,12.15 13.88,12.15
  Top 0.254: U$3.2 12.24,11.2 12.24,12.05 | v8.7,14.55 8.64,14.49 R9.1
  Top 0.305: U4.4 32.08,15.25 | C6.2 v28.38,18.13 v28.38,18.14 | v21.98,17.93 21.04,17.93 20.65,17.55 C100.P$2 | v22.59,14.76 22.59,15.26 C73.2 | C72.2 22.94,14.3 v22.56,13.92 22.56,13.82 22.84,13.54 23.07,13.54 | v2.67,4.95 2.67,5.71 3.03,6.07 C101.P$2 3.31,6.25 v3.31,4.95 | 8.71,8.55 8.82,8.66 9.1,8.66 | 9.19,7.28 v9.2,7.26 | v9.2,6.25 | 9.17,5.27 v9.2,5.23 | C19.2 8.53,8.25 8.7,8.42 C16.2 | C15.2 31.75,6.73 31.7,6.67 | C17.1 28.42,6.46 v28.68,6.2 | C102.P$2 18.52,6.99 | 8.04,18.51 v8.03,18.52 | C29.1 v9.58,17.91 | 10.65,17.88 v10.67,17.91 | 12.72,17.9 v12.73,17.91 | 13.76,17.9 v13.77,17.91 | v14.79,17.91 | 15.81,17.77 v15.68,17.91 | 17.35,17.39 C26.2 | U4.EP 31.49,15.96 31.83,16.31 31.58,16.56 U4.6 31.58,18.68 v31.65,18.75 | C20.1 5.42,14.45 5.42,15.41 C13.1 | C20.1 5.47,13.23 | v5.47,12.65 C22.1 5.45,13.35 | C20.1 C22.1 v4.88,13.38 | R24.2 3.13,16.59 | 3.13,16.59 v2.46,16.59 | C25.1 3.24,16.47 3.13,16.59 | v9.71,8.23 9.71,8.26 9.3,8.66 | 9.1,8.66 9.3,8.66 | 8.53,8.53 8.53,9.02 | 8.53,9.56 8.89,9.56 8.89,8.6 C16.2 | C31.2 12.78,8.43 12.6,8.26 | C35.2 C32.2 12.7,8.2 v12.17,8.2 | C35.2 12.78,6.18 C30.2 | C35.2 12.72,7.19 v12.17,7.19 | U1.18 25.37,9.57 25.56,9.57 U1.PAD@3 | U1.17 26.17,10.07 | R33.2 R10.1 | 8.51,9.75 9.07,9.75 v9.07,9.7 | v9.07,9.7 v8.59,9.7 8.59,8.67 8.71,8.55 | C16.2 8.71,8.55 | 8.71,8.55 8.71,8.67 8.17,9.21 8.17,9.79 | C16.2 8.71,9.14 9.1,9.53 | v9.07,9.7 9.07,8.89 9.3,8.66 | v8.87,9.25 9.1,9.02 9.1,8.66 | 30.58,15.79 U4.1 30.2,14.56 30.05,14.71 v30.05,14.78 30.05,14.96 29.83,15.19 C5.2
  Top 0.381: v22.48,16.05 22.56,15.98 v22.56,13.92 | C100.P$2 19.71,17.55 | C100.P$2 20.5,17.55 20.88,17.17 | C100.P$2 20.76,17.55 | C8.1 17.32,17.27 17.39,17.35 17.59,17.55 | C8.1 C4.1 | C4.1 C1.1 | C1.1 C21.1 | C21.1 C27.1 | C27.1 C23.1 | C23.1 C29.1 9.58,17.47 9.36,17.69 | C23.1 10.65,17.88 | C27.1 v11.69,17.91 | C21.1 12.72,17.9 | C1.1 13.76,17.9 | C4.1 v14.79,17.91 | C8.1 15.81,17.77 | C26.2 16.87,17.91 v16.39,17.91 | v27.05,15.77 27.01,15.74 27.01,15.48 27.16,15.33 R10.1
  Top 0.457: C58.2 22.76,12.21 23.04,12.5 23.04,13.28 | C59.2 23.07,13.27 23.07,13.54 23.07,14.29 C72.2 23.03,14.35 C73.2 23.03,15.99 v23.07,16.03 | v2.54,13.36 v2.55,13.36 C47.1 3.15,13.28 3.15,12.68 | C20.1 4.85,14.41 4.84,14.43 | C22.1 v4.88,13.38 | C13.1 4.85,15.45 4.83,15.47 | C24.2 8.52,4.28 8.46,4.22 | C24.2 8.52,6.24 C18.2 | C18.2 C19.2 | C19.2 8.53,9.02 8.53,9.56 | C19.2 9.19,7.28 | C18.2 v9.2,6.25 | C24.2 9.17,5.27 | R5.1 9.76,8.28 v9.71,8.23 | C37.2 25.93,4.52 v26.16,4.29 | v28.66,7.47 C74.1 28.09,7.44 28.09,6.99 | 28.09,6.99 C17.1 28.09,6.2 28.34,5.94 C49.2 | 28.09,6.99 28.19,6.88 v28.68,6.88 | C49.2 28.34,4.49 v28.33,4.47 | C49.2 28.34,5.83 28.68,6.17 v28.68,6.2 | 32.41,8.99 31.81,8.99 C11.1 C9.1 | C9.1 32.44,8 | v33,6.71 32.05,6.71 C15.2 | v33,5.31 32.83,5.47 C57.2 C15.2 | C15.2 31.77,6.98 C9.1
  Top 0.508: J2.@9 J2.9 | J2.@10 J2.10 | J1.10 9.91,21.64 J1.@10 | C102.P$2 18.47,6.93 v18.47,8.28 | C102.P$2 18.27,5.54 v17.94,5.21 | C102.P$2 18.32,6.78 19.36,6.78 | C101.P$2 3.13,6.63 3.13,8
  Top 0.762: 20.88,17.17 C3.2 | C100.P$2 17.59,17.55 | 17.39,17.35 17.35,17.39 | C12.2 8.04,18.51 | C12.2 8,17.73 7.12,17.73 | 9.36,17.69 C12.2 | 2.01,6.53 C101.P$2 3.08,6.58
  Top 1.016: 12.35,12.15 U$3.23 | J1.10 J1.9
  Top 1.524: J1.@9 J1.9 | J1.@10 J1.10
  Route2 0.508: 10.15,21.38 10.15,21.59 J1.10 | 10.15,21.38 10.15,19.87 v9.81,19.53 | J1.@10 10.16,21.38 10.15,21.38 | J1.@9 J1.9 12.7,19.53 v12.6,19.53 | J2.@10 J2.10 | J2.10 27.94,3.25 v27.38,3.25 | J2.@9 J2.9 | J2.9 25.4,3.28 25.65,3.28 | J2.9 J2.10
  Route15 0.152: 10.16,21.74 J1.10 | 12.7,22.27 12.7,21.72 J1.9
  Route15 0.305: v8.59,9.7 8.19,10.11 3.56,10.11 2.19,11.48 2.19,13.01 v2.54,13.36
  Route15 0.508: J2.@9 J2.9 | J2.@10 J2.10 | J1.@10 10.16,21.74 | J1.@9 12.7,21.72
  Bottom 1.524: 25.65,3.28 25.65,1.37 25.4,1.37 J2.9 J2.10 27.94,3.25 v27.38,3.25 | v12.6,19.53 12.7,19.63 J1.9 J1.10 10.11,21.54 10.11,19.84 v9.81,19.53
  other vias: 13.55,12.64 13.19,12.18 13.96,12.18 12.08,11.7 13.55,11.7 0.99,19.44 0.97,17.63 0.97,10.67 0.97,9.4 0.97,8.13 0.97,6.86 0.97,5.59 0.97,4.32 0.99,3.31 34.22,17.15 34.22,16.15 34.22,15.15 26.88,18.87 18.52,5.18 2.19,19.53 3.2,19.53 6,19.53 7.27,19.53 8.54,19.53 11.33,19.53 26.83,19.53 27.84,19.53 30.13,19.53 31.91,19.53 33.94,19.53 0.97,12.2 0.97,13.72 0.97,14.99 0.97,16.26 2.52,3.31 9.1,3.56 10.13,3.53 11.15,3.53 12.17,3.53 20.47,2.9 21.36,2.92 22.1,2.9 23.65,2.9 24.33,2.9 26.69,3.25 19.33,2.9 34.03,3.53 34.03,4.8 34.03,6.07 34.03,7.34 34.03,8.86 34.03,10.39 34.03,11.91 34.22,13.11 34.22,18.16 8.79,18.52 7.27,18.52 10.06,18.52 11.08,18.52 12.09,18.52 13.11,18.52 1.86,7.49 1.86,6.55 1.86,5.61 9.2,4.22 9.96,4.22 10.72,4.22 11.48,4.22 12.25,4.22 1.86,4.29 2.65,4.29 3.31,4.29 17.81,8.28 28.66,3.91 27.18,4.29 32.44,8.99 26.04,18.85 21.98,17.2 18.9,17.7 1.78,18.54 1.78,17.27 1.78,15.75 1.78,14.48 8.34,9.25 4.93,12.65 18.39,17.48 18.52,4.57 17.96,4.57 32.49,8 33,6.02 33,7.37 33,8.64 3.15,12.65 2.59,8 30.94,15.4 25.45,3.25 26.03,3.25 28.04,3.23
  pour Bottom (rank 3, no thermals): -1.7,29.34 47.43,29.34 47.43,-1.55 -1.7,-1.55
  pour Top (rank 3, no thermals): -2.7,31.57 42.57,31.57 42.57,-4.98 -2.7,-4.98
  pour Route2 (rank 4): -3.88,30.63 44.28,30.63 44.28,-3.23 -3.88,-3.23
  pour Route15 (rank 3): -2.99,29.97 45.83,29.97 45.83,-2.44 -2.99,-2.44
  pour Bottom (no thermals): 11.81,13.1 14.44,13.1 arc-90 14.71,12.83 14.71,11.43 arc-90 14.56,11.28 11.56,11.28 arc-90 11.41,11.43 11.41,12.85 arc-90
  pour Bottom (no thermals): 25.99,12.19 27.84,12.19 arc-90 28.22,11.81 28.22,9.93 arc-90 27.74,9.45 25.91,9.45 arc-90 25.45,9.91 25.45,11.66 arc-90
  cutout Top: 0.13,2.54 0.13,0 34.68,0 34.68,2.54
  cutout Top: 1.4,22.86 0,22.86 0,20.45 0,20.32 0,20.19 34.93,20.19 34.93,22.86 34.17,22.86
  cutout Bottom: -0.25,22.86 -0.25,20.19 35.18,20.19 35.18,22.86
  cutout Bottom: -0.25,2.54 -0.25,0 35.31,0 35.31,2.54
  cutout Top: 31.12,13.44 31.58,13.44 31.58,4.85 31.12,4.85
  cutout Top: 31.3,4.98 33.07,4.98 arc-90 33.3,4.75 33.3,3.15 arc90 33.61,2.84 34.45,2.84 arc-90 34.47,2.82 34.47,2.62 arc-90 34.4,2.54 33.46,2.54 arc-90 33.43,2.57 33.13,2.57 arc-90 33.05,2.64 arc-90 32.92,2.77 32.92,4.19 arc90 32.62,4.5 31.25,4.5 31.25,4.93 arc-90
  cutout Top: 28.73,7.75 arc-90 28.99,7.49 28.99,2.57 29.54,2.57 29.54,7.67 arc90 29.32,7.9 28.76,7.9 arc90 28.73,7.87
  cutout Top (no thermals): 19.69,9.02 17.53,9.02 arc90 17.26,8.75 17.39,8.62 arc-90 17.4,8.64 18.67,8.64 arc-90 19.56,7.75 19.56,4.83 arc90 19.82,4.57 25.15,4.57 arc90 25.66,5.08 25.66,6.1 25.4,6.1 25.4,5.51 arc-90 24.72,4.83 20.45,4.83 arc-90 20.25,5.03 20.25,7.88 arc-90 19.69,8.44
  cutout Top: 25.76,6.76 26.8,6.76 26.8,5.89 arc-90 26.78,5.87 25.79,5.87 arc-90 25.76,5.89
  cutout Top: 5.82,12.4 2.14,12.4 arc90 1.91,12.17 1.91,8.53 arc90 2.14,8.31 4.32,8.31 arc-90 4.45,8.18 4.45,8.15 4.6,8.15 4.6,8.59 arc90 4.58,8.61 2.44,8.61 arc-90 2.16,8.89 2.16,11.46 2.16,11.94 arc-90 2.42,12.19 2.49,12.19 5.85,12.19 5.85,12.4
  cutout Top: 26.47,17.91 26.47,16.79 25.71,16.79 25.96,17.91
  cutout Top: 10.72,7.7 11.26,7.7 11.26,5.94 arc-90 11.23,5.92 10.16,5.92 arc90 10.14,5.89 10.14,7.44 arc-90 10.39,7.7 10.7,7.7
  cutout Bottom: 30.33,12.7 30.33,10.79 33.58,10.79 33.58,12.7
  cutout Top: 25.35,12.57 25.35,10.24 25.61,10.24 25.61,12.04 28.02,12.04 28.02,9.6 25.66,9.6 25.66,9.42 28.22,9.42 28.22,12.57
  cutout Top: 11.47,13.18 11.47,12.98 15.45,12.98 15.45,12.97 15.75,12.97 15.75,13.18
  cutout Top: 9.67,14.02 9.67,10.76 10.57,10.76 10.7,10.76 10.7,11 10.2,11 10.2,14.09 9.68,14.09 9.68,14.03
  cutout Top: 15.84,11.42 10.31,11.42 10.31,11.12 15.84,11.12
  cutout Top: 15.63,12.94 15.63,11.43 15.67,11.43 15.94,11.43 15.94,11.44 15.94,12.95 15.64,12.95
ILIM
  Top 0.152: R33.1 26.28,14.31 26.61,13.99 26.61,13.43 26.56,13.38 U1.10
N$1
  Top 0.152: J2.@3 J2.3
N$2
  Top 0.152: U1.23 27.56,7.9 C74.2 27.15,7.44 C17.2 27.04,6.35 C49.1
N$3
  cutout Top (no thermals): 28.05,17.04 29.67,17.04 29.67,14.66 28.05,14.66
N$4  (via drill 0.2 pad 0.41)
  Top 0.152: v30,10.67 29.9,10.57 U1.3
  Bottom 0.152: TP2.P$1 30.97,10.93 30.71,10.67 v30,10.67
N$5  (via drill 0.2 pad 0.41)
  Top 0.152: 7.34,9.85 7.16,10.04 U6.D2
  Top 0.203: 7.34,9.85 7.47,9.72 v7.47,9.6
  Top 0.254: R17.1 8.81,11.95 | R9.2 8.6,12.93
  Top 0.305: 8.59,12.92 R9.2 8.64,12.01 R17.1 C14.1 8.81,10.66 9.15,10.31 v9.16,10.31
  Bottom 0.305: v9.16,10.31 8.18,10.31 v7.47,9.6
N$6
  Top 0.152: R5.2 12.05,8.91 12.05,9.53 12.74,10.22 U$3.3
  Top 0.203: C28.1 R6.1 R5.2
N$7  (via drill 0.2 pad 0.41)
  Top 0.152: v29.57,10.07 | v29.57,10.07 U1.2
  Bottom 0.152: TP1.P$1 32.89,11.37 32.61,11.09 31.89,11.09 31.03,10.24 29.74,10.24 v29.57,10.07
N$8
  Top 0.254: R17.2 9.73,11.89 9.73,12.89 R8.1
N$9
  Top 0.152: R6.2 10.97,6.74 10.97,5.66 R4.1
N$10
  Top 0.152: 12.3,0.59 12.7,0.59 J2.4 J2.@4
N$11
  Top 0.152: U$3.9 U$3.8 17.18,13.6 17.65,13.13 L3.1
  pour Top (no thermals): 14.1,13.92 17.77,13.92 arc-90 19.23,12.46 19.23,11.66 arc-90 18.98,11.4 16.16,11.4 arc-90 16.07,11.49 16.07,12.89 arc90 15.68,13.28 14.1,13.28
N$12
  Top 0.152: 6.25,10.92 5.95,10.92 5.43,11.45 5.13,11.45 | L1.1 5.13,11.45 | 5.72,10.86 5.13,11.45
  Top 0.203: U6.B1 5.72,10.86
  pour Top (isolate 0.254, no thermals): 2.47,11.96 5.54,11.96 arc-90 5.72,11.79 5.72,11.76 arc90 6.57,10.9 6.76,10.9 6.76,10.82 2.39,10.82 2.39,11.89 arc-90
N$15  (via drill 0.2 pad 0.41)
  Top 0.152: R16.2 4.07,17.57 3.31,18.34 v3.15,18.34 | U6.B2
  Top 0.178: 7.41,10.86 U6.B2
  Top 0.203: v8.13,11.35 7.9,11.35 7.41,10.86
  Bottom 0.152: v8.13,11.35 7.98,11.35 7.5,10.87 4.73,10.87 3.95,11.65 3.95,13.72 4.44,14.22 4.44,14.79 3.36,15.88 3.36,18.14 v3.15,18.34
N$16
  Top 0.203: 16.64,10.16 16.54,10.16 15.99,10.7 U$3.7 U$3.6
  pour Top (no thermals): 14.2,11.05 15.83,11.05 arc-90 16.03,10.85 arc90 16.18,10.69 18.95,10.69 arc-90 19.16,10.49 19.16,9.42 arc-90 18.98,9.25 15.9,9.25 arc-90 15.7,9.45 15.7,9.65 arc90 15.06,10.29 14.22,10.29 arc-90 14.2,10.31
N$17
  Top 0.152: L1.2 4.78,9.45
  Top 0.203: U6.C1 5.79,10.46 4.78,9.45
  pour Top (isolate 0.254, no thermals): 2.39,10.16 2.39,9.04 arc90 2.59,8.84 5.31,8.84 arc90 5.62,9.14 5.62,9.52 arc-90 6.51,10.41 6.8,10.41 6.8,10.52 5.47,10.52 arc90 5.34,10.39 arc-90 5.13,10.19 2.42,10.19 arc90
N$19
  Top 0.203: U$3.1 10.85,10.7 10.46,10.31 C36.2
N$21  (via drill 0.2, 0.2 pad 0.41)
  Top 0.152: v3.84,14.78 4.22,14.4 4.33,14.51 R28.1 C47.2
  Top 0.203: v12.67,14.37 12.74,14.29 U$3.12
  Route15 0.152: v12.67,14.37 12.35,14.05 10.36,14.05 9.62,13.31 9.62,11.71 8.48,10.57 3.81,10.57 2.72,11.66 2.72,12.83 2.98,13.08 2.98,13.92 v3.84,14.78
N$22  (via drill 0.2 pad 0.41)
  Top 0.152: v12,14.53 12.24,14.3 12.24,13.61 U$3.13 | v6.08,18.26 6.1,18.26 6.28,18.08 R23.2 5.83,17.11 3.6,17.11 R24.1 3.1,17.61
  Route15 0.152: v6.08,18.26 5.49,17.68 5.49,14.61 4.4,13.51 4.4,12.05 5.15,11.3 7.45,11.3 8.82,12.67 8.82,13.87 9.94,14.99 11.65,14.99 12,14.64 v12,14.53
N$48  (via drill 0.2 pad 0.41)
  Top 0.152: v31.68,13.84 v31.68,13.85 31.58,13.95 U4.3 | C5.1 28.18,14.24 v27.84,14.58
  Top 0.203: 29.31,14.25 28.38,14.25 R7.2 | 29.31,14.25 C5.1 29.31,14.18 | 29.31,14.25 29.33,14.25 | v27.84,14.58 27.86,14.58
  Route15 0.152: v31.68,13.84 31.42,13.59 28.83,13.59 v27.84,14.58
N$49  (via drill 0.2 pad 0.41)
  Top 0.152: U4.2 31.08,14.08 30.88,13.88 30.12,13.88 v29.98,14.02
  Top 0.203: v29.16,18.06 29.32,17.9 C6.1 29.32,16.43 R54.2
  Route15 0.152: v29.98,14.02 30.26,14.3 31.37,14.3 32.06,14.99 32.06,16.69 31.69,17.06 29.84,17.06 29.16,17.73 v29.16,18.06
OTG
  Top 0.152: U1.8 27.56,13.3 27.77,13.51 30.43,13.51 30.79,13.16 R3.2
PG  (via drill 0.2 pad 0.41)
  Top 0.152: U$3.14 11.74,14.11 11.35,14.5 v11.33,14.5
  Top 0.508: J1.@12 J1.12
  Route2 0.508: J1.@12 J1.12
  Route15 0.152: J1.12 5.08,18.06 4.58,17.55 4.58,14.68 3.59,13.69 3.59,11.48 4.14,10.92 8.33,10.92 9.26,11.86 9.26,13.61 10.09,14.43 11.26,14.43 v11.33,14.5
  Route15 0.508: J1.@12 J1.12
  Bottom 0.152: J1.12 4.83,22.27 | J1.12 4.83,21.72 | J1.12 5.29,21.13
REGN  (via drill 0.2 pad 0.41)
  Top 0.152: U1.22 27.06,8.23 26.8,7.97 | 25.93,6.55 C37.1 25.93,6.53 v26.42,7.02 26.54,7.14 26.54,7.71 26.8,7.97 | 26.8,7.97 | v27.03,18.14 27,18.11 R35.1
  Top 0.508: J2.@7 J2.7
  Route2 0.508: J2.@7 J2.7
  Route15 0.152: J2.7 19.94,1.45 19.94,4.78 20.48,5.32 24.72,5.32 v26.42,7.02 26.42,7.65 28.54,9.77 28.54,12.58 27.36,13.77 27.36,14.71 27.79,15.14 29.27,15.14 29.62,15.49 29.62,16.08 27.56,18.14 v27.03,18.14
  Route15 0.508: J2.@7 J2.7
SCL  (via drill 0.2 pad 0.41)
  Top 0.152: v29.77,11.82 29.52,11.57 U1.5 | U4.7 31.08,18.3 v30.97,18.41 | R30.2 32.39,10.12 v32.4,10.11
  Route2 0.508: J1.@2 J1.2
  Route15 0.152: J1.@2 J1.2 30.48,21.43 30.48,21.19 30.48,20.62 30.97,20.14 v30.97,18.41 31.11,18.27 33.06,18.27 33.42,17.91 33.42,12.81 32.72,12.1 30.05,12.1 v29.77,11.82 29.38,11.82 28.96,11.4 28.96,10.07 29.39,9.64 30.04,9.64 30.36,9.96 32.25,9.96 v32.4,10.11
  Route15 0.203: J1.@2 30.48,21.19
  Route15 0.508: J1.@2 30.48,21.43
  Bottom 0.152: J1.@2 30.43,22.8 30.19,22.78
  Bottom 0.203: J1.@2 J1.2
SDA  (via drill 0.2 pad 0.41)
  Top 0.152: v30.23,18.24 v30.24,18.24 30.58,17.9 U4.8 | U1.6 28.78,12.37 28.96,12.55 v29.47,12.55 29.85,12.55 30.33,12.07 30.33,11.55 30.78,11.1 R36.2
  Top 0.508: J1.@3 J1.3
  Route2 0.508: J1.@3 J1.3
  Route15 0.152: v29.47,12.55 29.49,12.58 32.54,12.58 33.05,13.09 33.05,17.68 32.82,17.91 30.53,17.91 30.23,18.21 v30.23,18.24 30.23,18.69 27.94,20.98 J1.3
  Route15 0.508: J1.@3 J1.3
  Bottom 0.152: J1.@3 J1.3
SW1
  Top 0.152: L7.P$1 22.24,5.7 | U1.19 24.99,8.26 | 24.99,8.26 24.93,8.2 C2.2 | U1.20 26.06,8.38 25.91,8.23 25.02,8.23 24.99,8.26
  Top 0.305: 22.71,5.7 L7.P$1
  pour Top (isolate 0.254, no thermals): 24.16,9.19 26.09,9.19 arc-90 26.22,9.07 26.22,8.46 arc-90 25.96,8.2 25.38,8.2 arc90 25.25,8.08 25.25,5.56 arc-90 24.59,4.9 20.58,4.9 arc-90 20.43,5.05 20.43,6.73 arc-90 20.55,6.86 23.65,6.86 arc90 23.78,6.99 23.78,8.81 arc-90
TS  (via drill 0.2 pad 0.41)
  Top 0.152: R35.2 26.04,18.14 v26.06,18.16 | U1.12 25.56,13.26 26.02,13.72 v26.14,13.72 26.06,13.63 U1.11 | 26.06,17.42 R34.1
  Top 0.203: R35.2 26.06,17.42
  Top 0.508: J1.@5 J1.5
  Route2 0.508: J1.@5 J1.5
  Route15 0.152: J1.@5 J1.5 22.86,21.55 22.86,21.36 23.7,20.52 24.54,20.52 25.61,19.46 25.61,18.62 v26.06,18.16 26.04,18.14 26.04,13.82 v26.14,13.72
  Route15 0.508: J1.@5 22.86,21.55
VBAT  (via drill 0.2 pad 0.41)
  Top 0.203: R54.1 27.8,16.95 v27.8,16.98
  Top 0.305: 24.77,17.65 24.53,17.32 C3.1 | 24.03,15.31 C73.1 24.02,15.21 C72.1
  Top 0.508: J1.@6 J1.6 | J1.@7 J1.7 | J1.@8 J1.8
  Top 1.524: 15.24,19.38 J1.8 J1.7 | J1.7 17.78,19.53 17.76,19.3 | 20.32,19.38 J1.6 J1.7
  Route2 0.508: J1.@7 J1.7 | J1.@6 J1.6 | J1.@8 J1.8
  Route15 0.152: 15.24,21.67 J1.8
  Route15 0.508: J1.@8 15.24,21.67 | J1.@7 J1.7 | J1.@6 J1.6
  Bottom 0.152: J1.8 J1.7 17.66,21.59
  Bottom 0.203: v27.8,16.98 27.56,17.22 24.9,17.22
  Bottom 1.524: 17.66,21.59 J1.8 15.24,19.59 14.99,19.33 | v17.53,19.84 17.78,20.09 J1.7 J1.6 20.07,21.59 20.07,19.33
  other vias: 24.01,13.62 24.77,14.25 14.48,19.84 15.5,19.84 16.51,19.84 18.54,19.84 19.56,19.84 20.58,19.84 14.48,18.82 15.5,18.82 16.51,18.82 17.53,18.82 18.54,18.82 19.56,18.82 20.58,18.82 24.77,15.52 24.77,12.98 24.01,12.35 24.01,16.16
  pour Top (isolate 0.254, no thermals): 24.08,11.51 arc-90 23.63,11.96 23.63,18.14 arc90 23.19,18.57 14.81,18.57 arc-90 14.05,19.33 14.05,22.76 arc-90 14.18,22.89 14.3,22.89 arc90 14.33,22.86 19.92,22.86 arc-90 19.94,22.89 20.81,22.89 arc-90 21.04,22.66 21.04,20.47 arc90 21.39,20.12 24.9,20.12 arc-90 25.18,19.84 25.18,11.51
  pour Route15 (isolate 0.254, no thermals): 14.23,22.86 14.23,18.8 arc90 14.48,18.54 23.25,18.54 arc-90 23.63,18.16 23.63,12.26 arc90 24.52,12.03 arc90 25.02,12.54 25.02,20.19 20.96,20.19 arc-90 20.83,20.32 20.83,22.86
  pour Bottom (isolate 0.305, no thermals): 24.72,20.24 14.3,20.24 arc90 14.18,20.12 14.18,18.72 arc90 14.41,18.49 23.22,18.49 arc-90 23.68,18.03 23.68,12.37 arc90 23.98,12.06 24.69,12.06 arc90 25.12,12.5 25.12,19.84 arc90
VCC  (via drill 0.2 pad 0.41)
  Top 0.152: C30.1 14.28,5.91 | 14.38,9.37 v14.32,9.32 C31.1 | U$3.5 13.74,10.23 13.55,10.03
  Top 0.203: U$3.4 13.24,10.35 13.55,10.05 13.55,10.03 13.55,9.49 C31.1 C32.1 C35.1 13.72,6.51 | C30.1 14.09,6.14 | J2.@6 17.58,0.61 | 17.58,0.61 J2.6 | 17.53,1.68 17.53,1.52 17.53,0.67 17.58,0.61
  Top 0.305: C28.2 R4.2 9.93,5.2 v9.83,5.09
  Top 0.508: J2.5 15.17,1.14 15.17,0.13 J2.@5 | J2.@6 17.63,0.05 17.63,1.42 17.53,1.52 | C102.P$1 15.63,5.13 15.26,4.77 v15.24,4.77 | v15.24,4.77 15.06,4.59 15.06,3.68 v15.24,3.5 14.69,4.05 14.69,4.77 v15.24,4.77
  Top 0.635: 13.87,6.17 13.87,4.97
  Top 1: 14.82,2.38 13.83,3.36
  Top 1.016: J2.@5 15.04,1.09 15.2,1.25
  Top 1.524: 14.04,4.79 14.04,3.7 | J2.5 15.24,3.42 15.24,3.43 | J2.6 17.78,2.68
  Route2 0.508: J2.@6 J2.6 J2.5 J2.@5
  Route15 0.152: J2.@5 J2.5 | J2.@6 17.78,1.22 J2.6
  Route15 0.203: 13.97,5.47 13.96,5.47 13.91,5.52
  Route15 0.305: v9.83,5.09 10.71,5.98 13.45,5.98 13.91,5.52 | 13.96,5.47 v13.96,4.78 v13.97,4.77
  Route15 0.508: J2.@5 v15.24,3.49 v15.24,3.5 | J2.5 17.74,1.27 17.78,1.22 | J2.@6 17.78,2.63 17.89,2.75 17.89,0.83 17.91,0.81
  Bottom 0.508: J2.@6 17.58,1.19 | 17.58,1.19 J2.6 | J2.@5 J2.5 | 17.51,1.27 17.58,1.19
  Bottom 1.524: 17.51,1.27 J2.5 15.22,1.28 15.22,4.45 | 17.58,2.79 17.58,1.27
  other vias: 14.35,8.25 15.39,8.22 16.61,8.22 16.51,4.77 13.97,3.5 16.51,3.5 14.35,7.16
  pour Route15 (isolate 0.305): 13.47,9.91 14.36,9.91 arc-90 14.48,9.78 arc90 14.61,9.65 15.12,9.65 arc-90 15.37,9.4 15.37,8.89 arc90 15.63,8.64 16.82,8.64 arc-90 17.09,8.37 17.09,4.25 arc90 17.78,3.56 18.29,3.56 arc-90 18.55,3.3 18.55,0.51 14.23,0.51 14.23,2.29 arc90 13.72,2.79 13.59,2.79 arc-90 13.21,3.17 13.21,9.65 arc-90
  pour Top (isolate 0.305, no thermals): 13.16,11.05 13.77,11.05 arc-90 13.85,10.97 13.85,10.34 arc90 14.38,9.8 15.02,9.8 arc-90 15.25,9.57 15.25,9.07 arc90 15.63,8.69 16.69,8.69 arc-90 17.1,8.28 17.1,4.01 arc90 17.56,3.56 18.01,3.56 arc-90 18.5,3.07 18.5,0.23 arc90 18.55,0.18 14.46,0.18 arc-90 14.41,0.23 14.41,2.06 arc90 13.67,2.79 13.52,2.79 arc-90 13.19,3.12 13.19,4.72 arc-90 13.29,4.83 arc90 13.42,4.95 13.42,9.53 13.16,9.78
  pour Bottom (no thermals): 14.36,9.91 arc-90 14.46,9.8 arc90 14.61,9.65 15.17,9.65 arc-90 15.37,9.45 15.37,8.86 arc90 15.6,8.64 16.87,8.64 arc-90 17.1,8.41 17.1,4.19 arc90 17.73,3.56 18.34,3.56 arc-90 18.55,3.35 18.55,0.1 arc90 18.6,0.05 14.28,0.05 14.28,2.34 arc90 13.82,2.79 13.77,2.79 arc-90 13.34,3.23 13.34,9.65 arc-90
VIN  (via drill 0.2 pad 0.41)
  Top 0.152: C57.1 30.73,4.92 30.38,4.57 30.31,4.5 | J2.12 v30.87,3.43 v29.82,3.43 30.05,3.43 | 30.38,2.87 30.38,2.64 | J2.11 30.33,1.42 | U1.24 28.06,8.22 28.2,8.08 29.62,8.08 v29.75,8.2 | U1.24 28.21,9 | U1.1 28.5,9.57 28.48,9.55 | U1.24 28.06,8.94 v28.83,8.94
  Top 0.203: U1.24 28.06,8.82 30.6,8.82 | 30.37,8.59 30.38,8.59
  Top 0.305: 28.21,9 28.34,9 28.48,9.14 28.48,9.55
  Top 0.508: J2.@11 J2.11 | J2.@12 J2.12
  Top 1.016: J2.11 30.38,1.37 30.38,2.64 | 30.38,8.59 30.38,4.57 | 30.31,4.5 30.31,2.57 | 32.9,1.77 32.9,1.02 | J2.@12 33.02,1.64 32.01,2.66
  Top 1.524: 30.33,1.42 30.33,7.14 | J2.12 32.9,1.77 32.01,2.66 | 32.01,2.66 31.19,3.48 | 30.31,2.57 30.38,2.64 30.4,2.66 32.01,2.66
  Top 1.778: J2.11 30.48,3
  Route2 0.508: J2.@12 J2.12 J2.11 J2.@11
  Route15 0.152: 30.48,1.25 J2.11
  Route15 0.508: J2.@11 30.48,1.25 | J2.@12 J2.12
  Bottom 1.016: 32.9,0.76 33.02,0.89 J2.12 J2.@12 32.87,0.15 32.87,1.78
  Bottom 1.524: J2.11 30.48,3.03 | 32.03,2.62 32.87,1.78 32.87,1.38
  other vias: 29.8,4.55 30.87,4.55 29.82,5.97 29.75,7.37 29.75,8.92 28.86,8.26 31.98,3.43 31.96,4.06
  pour Top (isolate 0.305, no thermals): 31.02,4.75 arc90 31.42,4.34 32.64,4.34 arc-90 32.9,4.09 32.9,2.97 arc-90
  pour Route15 (isolate 0.381, no thermals): 28.88,9.27 30.74,9.27 arc-90 31.12,8.89 31.12,4.95 arc90 31.37,4.7 32.26,4.7 arc-90 32.9,4.06 32.9,3.05 arc90 33.02,2.92 arc-90 33.66,2.29 33.66,0 29.47,0 29.47,7.62 arc90 29.01,8.08 28.78,8.08 arc-90 28.58,8.28 28.58,8.97 arc-90
  pour Bottom (isolate 0.406, no thermals): 28.83,9.22 30.87,9.22 arc-90 31.04,9.04 31.04,4.95 arc90 31.63,4.37 32.62,4.37 arc-90 32.92,4.06 32.92,2.57 arc-90 32.9,2.54 29.65,2.54 arc-90 29.47,2.72 29.47,7.67 arc90 29.06,8.08 28.88,8.08 arc-90 28.63,8.33 28.63,9.02 arc-90
  pour Top (isolate 0.406, no thermals): 28.48,9.73 29.16,9.73 arc-90 29.29,9.6 29.29,9.5 29.29,9.37 arc90 29.34,9.32 30.89,9.32 arc-90 31.02,9.19 31.02,4.62 arc90 31.25,4.39 32.64,4.39 arc-90 32.8,4.24 32.8,2.57 arc-90 32.77,2.54 29.75,2.54 arc-90 29.6,2.69 29.6,7.59 arc90 29.29,7.9 27.99,7.9 arc-90 27.92,7.98 27.92,8.2 27.92,8.94 27.92,9.22 arc-90 27.97,9.27 28.25,9.27 28.43,9.27 arc90 28.48,9.32
VSYS  (via drill 0.2 pad 0.41)
  Top 0.152: 22.3,9 22.1,9 L7.P$2 | 6.25,16.61 R23.1 | 6.43,16.43 6.25,16.61 | 8.33,16.2 8.17,16.04 C12.1 | U$3.10 U$3.11 | R16.1 5.37,16.61 6.25,16.61 | 6.71,11.67 6.76,11.61 6.78,11.59 6.78,11.8 6.58,12.01 | 6.71,11.67 6.58,11.79 | 6.58,11.79 6.58,11.7 6.37,11.91 | 6.58,11.79 6.58,12.01 | v6.36,11.92 6.37,11.91 | 6.58,12.01 6.45,12.01 v6.36,11.92 | U6.A1 6.66,11.26 6.37,11.55 6.37,11.91 | U6.A1 6.49,11.26 6.14,11.61 6.23,11.76 | 6.23,11.76 6.23,11.69 v6.36,11.92 | 6.23,11.76 6.23,11.79 | 6.23,11.79 v6.36,11.92 | 6.23,11.79 6.42,11.6 U6.A1 | U6.A1 6.75,11.36 | 6.75,11.36 6.71,11.67 | v6.36,11.92 6.61,11.56 6.75,11.36 | v6.36,11.92 6.13,11.69 6.13,11.51 6.37,11.26 U6.A1
  Top 0.203: L7.P$2 21.49,9.37 | U6.A1 6.76,11.61
  Top 0.305: 22.29,9.18 22.1,9 | 20.38,14.86 C100.P$1 | R23.1 5.37,16.61 | R14.1 R16.1
  other vias: 21.95,10.8 21.95,10.22 21.83,14.74 21.83,13.98 22.56,10.8 20.15,10.22 6.84,12.71 7.02,16.32 7.02,15.05 7.02,13.78 7.65,14.41 7.65,13.14 21.27,10.22 22.56,10.22 20.68,10.22
  pour Top (no thermals): 13.47,12.49 arc90 13.58,12.38 14.19,12.38
  pour Route15 (isolate 0.254): 16.26,16.76 6.35,16.76 arc90 6.1,16.51 6.1,11.94 arc90 6.35,11.68 6.61,11.68 arc90 6.86,11.94 6.86,12.19 arc-90 7.12,12.45 7.62,12.45 arc90 7.88,12.7 7.88,14.48 arc-90 8.84,15.44 12.63,15.44 arc-90 13.34,14.73 13.34,14.35 18.93,14.35 arc-90 19.82,13.46 19.82,8.31 arc90 20.25,7.87 22.61,7.87 arc90 23.37,8.64 23.37,10.16 arc-90 23.63,10.41 24.13,10.41 arc90 24.39,10.67 24.39,10.92 arc90 24.13,11.18 22.36,11.18 arc-90 22.1,11.43 22.1,15.42 arc90 21.19,16.33 16.72,16.33 arc-90 16.62,16.43 16.59,16.43 arc90
  pour Top (isolate 0.254, no thermals): 6.1,16.51 6.1,11.66 arc90 6.2,11.56 6.66,11.56 arc90 6.86,11.76 6.86,12.06 arc-90 7.12,12.32 7.75,12.32 arc90 7.88,12.45 7.88,14.48 arc-90 8.64,15.24 12.7,15.24 arc-90 13.09,14.86 13.09,13.21 13.8,13.21 13.8,14.05 arc-90 14.13,14.38 18.88,14.38 arc-90 19.82,13.44 19.82,8.64 arc90 20.58,7.87 22.99,7.87 arc90 23.37,8.26 23.37,10.29 arc-90 23.55,10.46 25.28,10.46 25.28,11.18 22.36,11.18 arc-90 22.1,11.43 22.1,15.37 arc90 21.11,16.36 16.77,16.36 arc-90 16.54,16.59 arc90 16.39,16.74 6.33,16.74 arc90
  pour Bottom: 21.24,16.99 6.4,16.99 arc90 6.1,16.69 6.1,11.94 arc90 6.35,11.68 6.61,11.68 arc90 6.86,11.94 6.86,12.24 arc-90 7.07,12.45 7.6,12.45 arc90 7.88,12.73 7.88,14.5 arc-90 8.72,15.34 12.91,15.34 arc-90 13.59,14.66 13.59,14.38 18.9,14.38 arc-90 19.82,13.46 19.82,10.27 arc90 20.23,9.86 23.07,9.86 arc90 23.37,10.16 arc-90 23.63,10.41 23.88,10.41 arc90 24.13,10.67 24.13,10.9 arc90 23.85,11.18 22.38,11.18 arc-90 22.1,11.46 22.1,16.13 arc90

### Text on the board
Top: T1
Route2: G2
Route15: P3
Bottom: B4
tPlace: ELEKTRA-PMIC v0.3 | 20240323 | 1
bPlace: EN | PG | RST | GND | GND | VBAT | VBAT | VBAT | TS | !INT | SDA | SCL | CHG | ELEKTRA-PMIC v0.3 | 20240323 | 3V3 | 3V3 | VCC | VCC | GND | GND | VIN | VIN | NC | NC | REGN | NC
tValues: 1.5uH | 1.5uH
Reference: 40*27mm
tDocu: NR3015T2R2M